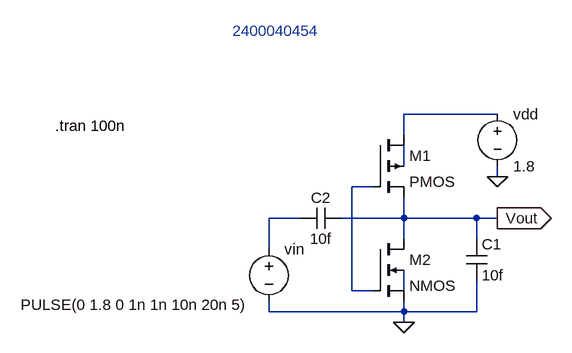
[diagram p0: schematic post1.asc]
post1.asc, the LTspice schematic file:
Version 4.1
SHEET 1 880 680
WIRE 336 -16 192 -16
WIRE 192 16 192 -16
WIRE 192 64 192 32
WIRE 336 80 336 64
WIRE 144 96 112 96
WIRE 32 144 -16 144
WIRE 192 144 192 112
WIRE 192 144 96 144
WIRE 304 144 192 144
WIRE 336 144 304 144
WIRE 192 176 192 144
WIRE 304 176 304 144
WIRE -16 192 -16 144
WIRE 112 256 112 96
WIRE 144 256 112 256
WIRE 192 256 192 224
WIRE -16 288 -16 272
WIRE 192 288 192 272
WIRE 192 288 -16 288
WIRE 304 288 304 240
WIRE 304 288 192 288
WIRE 192 304 192 288
FLAG 336 80 0
FLAG 192 304 0
FLAG 336 144 Vout
IOPIN 336 144 Out
SYMBOL pmos4 144 16 R0
SYMATTR InstName M1
SYMATTR Value2 l=45n w=1u
SYMBOL nmos4 144 176 R0
SYMATTR InstName M2
SYMATTR Value2 l=45n w=1u
SYMBOL voltage -16 176 R0
WINDOW 3 -382 101 Left 2
WINDOW 123 0 0 Left 0
WINDOW 39 0 0 Left 0
SYMATTR InstName vin
SYMATTR Value PULSE(0 1.8 0 1n 1n 10n 20n 5)
SYMBOL voltage 336 -32 R0
SYMATTR InstName vdd
SYMATTR Value 1.8
SYMBOL cap 288 176 R0
SYMATTR InstName C1
SYMATTR Value 10f
SYMBOL cap 32 160 R270
WINDOW 0 32 32 VTop 2
WINDOW 3 0 32 VBottom 2
SYMATTR InstName C2
SYMATTR Value 10f
TEXT -345 2 Left 2 !.tran 100n
TEXT -72 -144 Left 2 ;2400040454

The netlist it stands for:
* post1.asc
M1 N001 N003 Vout N002 PMOS l=45n w=1u
M2 Vout N003 0 N005 NMOS l=45n w=1u
vin N004 0 PULSE(0 1.8 0 1n 1n 10n 20n 5)
vdd N001 0 1.8
C1 Vout 0 10f
C2 N004 Vout 10f
.model NMOS NMOS
.model PMOS PMOS
.lib standard.mos
.tran 100n
* 2400040454
.backanno
.end